# Altium schematic sheet 稳压&外部AD.SchDoc
size A4
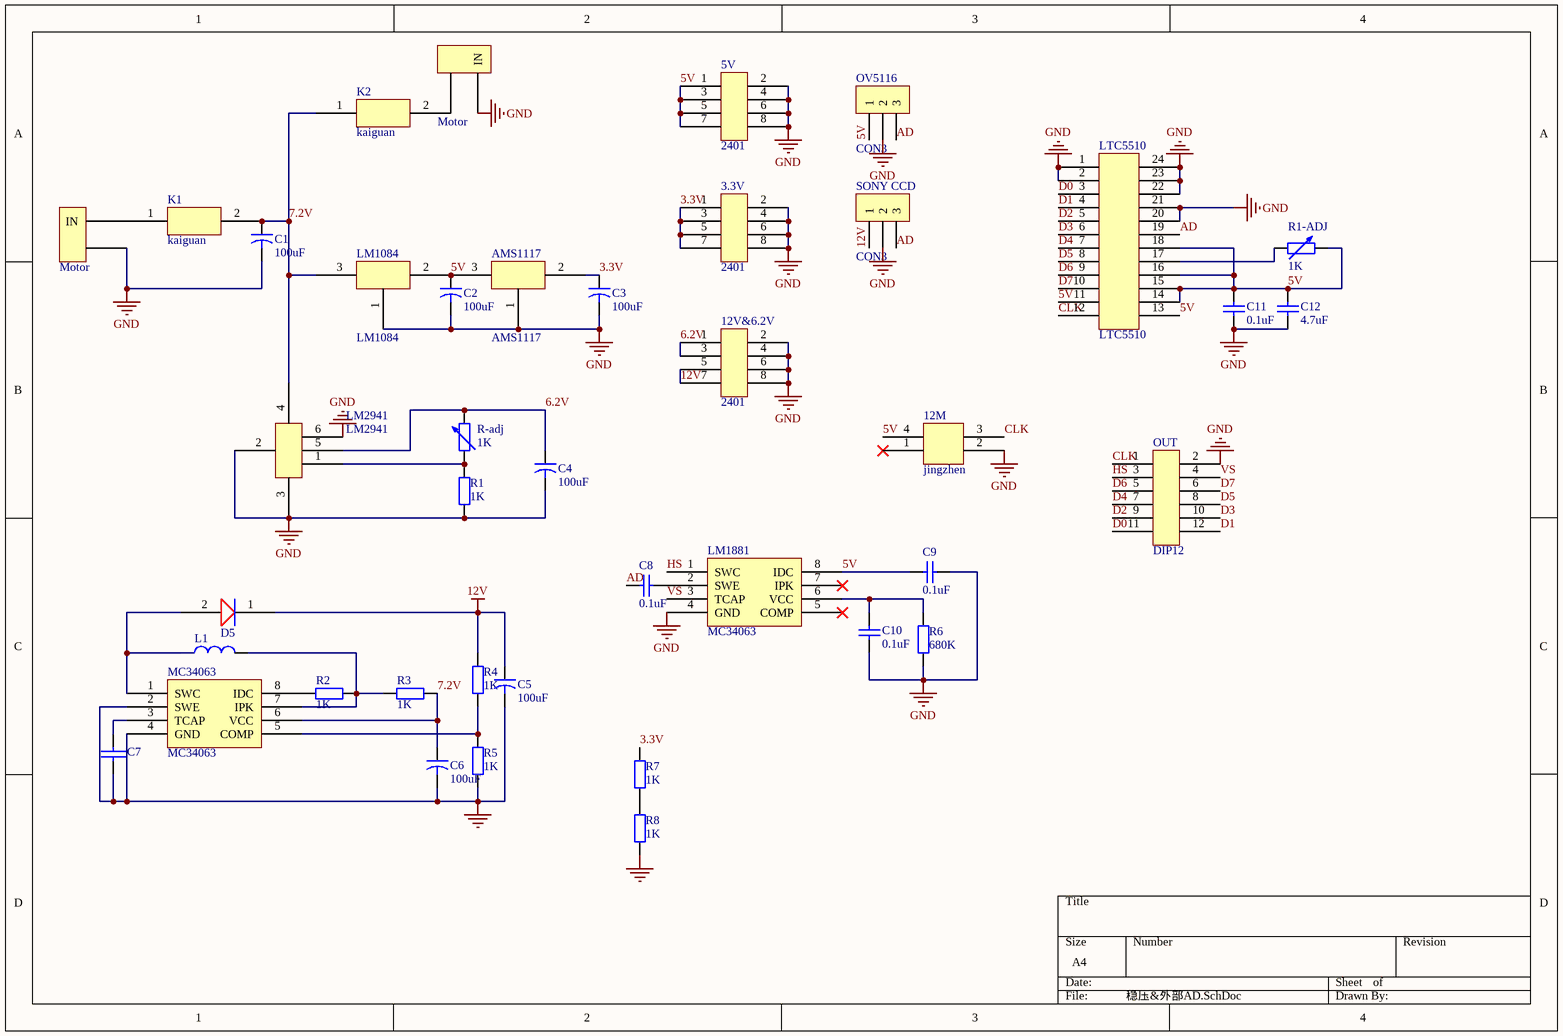
[diagram p0: 稳压&外部AD.SchDoc]

## Parts
3.3V  2401  [IDC-8]
5V  2401  [IDC-8]
12M  jingzhen  [3225]
12V&6.2V  2401  [IDC-8]
AMS1117  AMS1117  [SOT223]
C1  value 100uF  [CAPPR2-5x6.8]  (hidden comment: Cap2)
C2  value 100uF  [CAPPR2-5x6.8]  (hidden comment: Cap2)
C3  value 100uF  [CAPPR2-5x6.8]  (hidden comment: Cap2)
C4  value 100uF  [CAPPR2-5x6.8]  (hidden comment: Cap2)
C5  value 100uF  [CAPPR2-5x6.8]  (hidden comment: Cap2)
C6  value 100uF  [CAPPR2-5x6.8]  (hidden comment: Cap2)
C7  CAP  [0805]  (value not drawn)
C8  value 0.1uF  [0805]  (hidden comment: Cap1)
C9  value 0.1uF  [0805]  (hidden comment: Cap1)
C10  value 0.1uF  [0805]  (hidden comment: Cap1)
C11  value 0.1uF  [0805]  (hidden comment: Cap1)
C12  value 4.7uF  [0805]  (hidden comment: Cap1)
D5  1N5819  [SMA]  (value not drawn)
IN  Motor  [connection]
K1  kaiguan  [SIP3]
K2  kaiguan  [SIP3]
L1  L  [L 5*5mm]  (value not drawn)
LM1084  LM1084  [LM1084]
LM1881  MC34063  [SO-8]
LM2941  LM2941  [TO-263-5]
LTC5510  LTC5510  [SOP127P780X200-24N]
MC34063  MC34063  [SO-8]
Motor  Motor  [connection]
OUT  DIP12  [IDC-12]
OV5116  CON3  [SIP3]
R1  value 1K  [0805]  (hidden comment: Res2)
R1-ADJ  value 1K  [SIP3]  (hidden comment: Res Adj2)
R2  value 1K  [0805]  (hidden comment: Res2)
R3  value 1K  [0805]  (hidden comment: Res2)
R4  value 1K  [0805]  (hidden comment: Res2)
R5  value 1K  [0805]  (hidden comment: Res2)
R6  value 680K  [0805]  (hidden comment: Res2)
R7  value 1K  [0805]  (hidden comment: Res2)
R8  value 1K  [0805]  (hidden comment: Res2)
R-adj  value 1K  [SIP3]  (hidden comment: Res Adj2)
SONY_CCD  CON3  [SIP3]

## Nets
12V: 12V&6.2V.5(SCK) 12V&6.2V.7(MISO) C5.1 D5.1(OUT) R4.2 SONY_CCD.1
GND: 3.3V.2(VCC) 3.3V.4(CSN) 3.3V.6(MOSI) 3.3V.8(IRQ) 5V.2(VCC) 5V.4(CSN) 5V.6(MOSI) 5V.8(IRQ) 12M.2(GND) 12V&6.2V.2(VCC) 12V&6.2V.4(CSN) 12V&6.2V.6(MOSI) 12V&6.2V.8(IRQ) AMS1117.1(GND) C1.2 C2.2 C3.2 C4.2 C5.2 C6.2 C7.2 C9.2 C10.1 C11.1 C12.1 IN.2(OUT) LM1084.1(GND) LM1881.4(GND) LM2941.2(OFF) LM2941.3(GND) LM2941.6(OUT) LTC5510.1 LTC5510.2 LTC5510.20 LTC5510.21 LTC5510.22 LTC5510.23 LTC5510.24 MC34063.2(SWE) MC34063.4(GND) Motor.1(IN) OUT.2 OV5116.2 R1.1 R5.1 R6.1 R8.1 SONY_CCD.2
3.3V: 3.3V.1(GND) 3.3V.3(CE) 3.3V.5(SCK) 3.3V.7(MISO) AMS1117.2(OUT) C3.1 R7.2
5V: 5V.1(GND) 5V.3(CE) 5V.5(SCK) 5V.7(MISO) 12M.4(VCC) AMS1117.3(IN) C2.1 C9.1 C11.2 C12.2 LM1084.2(OUT) LM1881.8(IDC) LTC5510.11 LTC5510.13 LTC5510.14 LTC5510.15 LTC5510.16 LTC5510.18 OV5116.1 R1-ADJ.2
6.2V: 12V&6.2V.1(GND) 12V&6.2V.3(CE) C4.1 LM2941.5(OUT) R-adj.2
7.2V: C1.1 C6.1 K1.2(IN) K2.1(IN) LM1084.3(IN) LM2941.4(IN) MC34063.6(VCC) R3.1
AD: C8.1 LTC5510.19 OV5116.3 SONY_CCD.3
CLK: 12M.3(OUT) LTC5510.12 OUT.1
D0: LTC5510.3 OUT.11
D1: LTC5510.4 OUT.12
D2: LTC5510.5 OUT.9
D3: LTC5510.6 OUT.10
D4: LTC5510.7 OUT.7
D5: LTC5510.8 OUT.8
D6: LTC5510.9 OUT.5
D7: LTC5510.10 OUT.6
HS: LM1881.1(SWC) OUT.3
VS: LM1881.3(TCAP) OUT.4
NetC7_1: C7.1 MC34063.3(TCAP)
NetC8_2: C8.2 LM1881.2(SWE)
NetC10_2: C10.2 LM1881.6(VCC) R6.2
NetD5_2: D5.2(IN) L1.2 MC34063.1(SWC)
NetIN_1: IN.1(IN) K1.1(IN)
NetK2_2: K2.2(IN) Motor.2(OUT)
NetL1_1: L1.1 MC34063.7(IPK) R2.1 R3.2
NetLM2941_1: LM2941.1(ADJ) R1.2 R-adj.1
NetLTC5510_17: LTC5510.17 R1-ADJ.1
NetMC34063_5: MC34063.5(COMP) R4.1 R5.2
NetMC34063_8: MC34063.8(IDC) R2.2
NetR7_1: R7.1 R8.2

Not connected (* = marked no-connect by the designer): 12M 1(NC)*; LM1881 5(COMP)* 7(IPK)*

## Library data of the parts
C1-C6 = Cap2: Capacitor; Published: 23-Sep-2002; PackageReference: CAPR5-4X5; Publisher: Altium Limited
C8-C12 = Cap1: Capacitor; Published: 8-Jun-2000; LatestRevisionDate: 17-Jul-2002; LatestRevisionNote: Re-released for DXP Platform.; PackageReference: RAD-0.3; Publisher: Altium Limited
R1-R8 = Res2: Resistor; Published: 8-Jun-2000; LatestRevisionDate: 17-Jul-2002; LatestRevisionNote: Re-released for DXP Platform.; PackageReference: AXIAL-0.4; Publisher: Altium Limited
R1-ADJ R-adj = Res Adj2: Variable Resistor; Set Position: 0.5; Published: 8-Jun-2000; LatestRevisionDate: 17-Jul-2002; LatestRevisionNote: Re-released for DXP Platform.; PackageReference: AXIAL-0.6; Publisher: Altium Limited